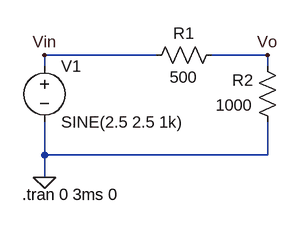
[diagram p0: schematic attenuation_circuit.asc]
attenuation_circuit.asc, the LTspice schematic file:
Version 4
SHEET 1 880 680
WIRE 112 128 -48 128
WIRE 272 128 192 128
WIRE -48 144 -48 128
WIRE 272 144 272 128
WIRE -48 272 -48 224
WIRE 272 272 272 224
WIRE 272 272 -48 272
WIRE -48 304 -48 272
FLAG -48 304 0
FLAG 272 128 Vo
FLAG -48 128 Vin
SYMBOL voltage -48 128 R0
WINDOW 123 0 0 Left 0
WINDOW 39 0 0 Left 0
SYMATTR InstName V1
SYMATTR Value SINE(2.5 2.5 1k)
SYMBOL res 208 112 R90
WINDOW 0 0 56 VBottom 2
WINDOW 3 32 56 VTop 2
SYMATTR InstName R1
SYMATTR Value 500
SYMBOL res 288 240 R180
WINDOW 0 36 76 Left 2
WINDOW 3 36 40 Left 2
SYMATTR InstName R2
SYMATTR Value 1000
TEXT -80 328 Left 2 !.tran 0 3ms 0

The netlist it stands for:
* attenuation_circuit.asc
V1 Vin 0 SINE(2.5 2.5 1k)
R1 Vo Vin 500
R2 0 Vo 1000
.tran 0 3ms 0
.backanno
.end

* Results of the author's LTspice run, read from the files saved beside the schematic
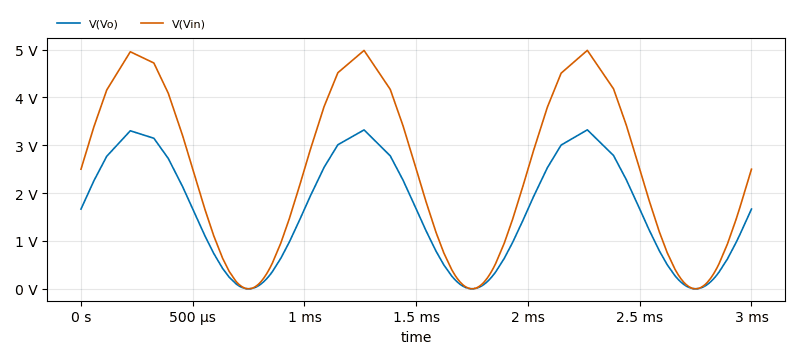
[diagram p1: Transient Analysis of attenuation_circuit.asc, plotted from the saved traces]
* Transient Analysis, 1 run:
*   V(Vo): min 141.3 µV, max 3.322 V, average 1.651 V, rms 2.022 V, last 1.667 V
*   V(Vin): min 0 V, max 4.984 V, average 2.476 V, rms 3.033 V, last 2.5 V